# Altium schematic sheet ZYNQ_SOC.SchDoc
size A4
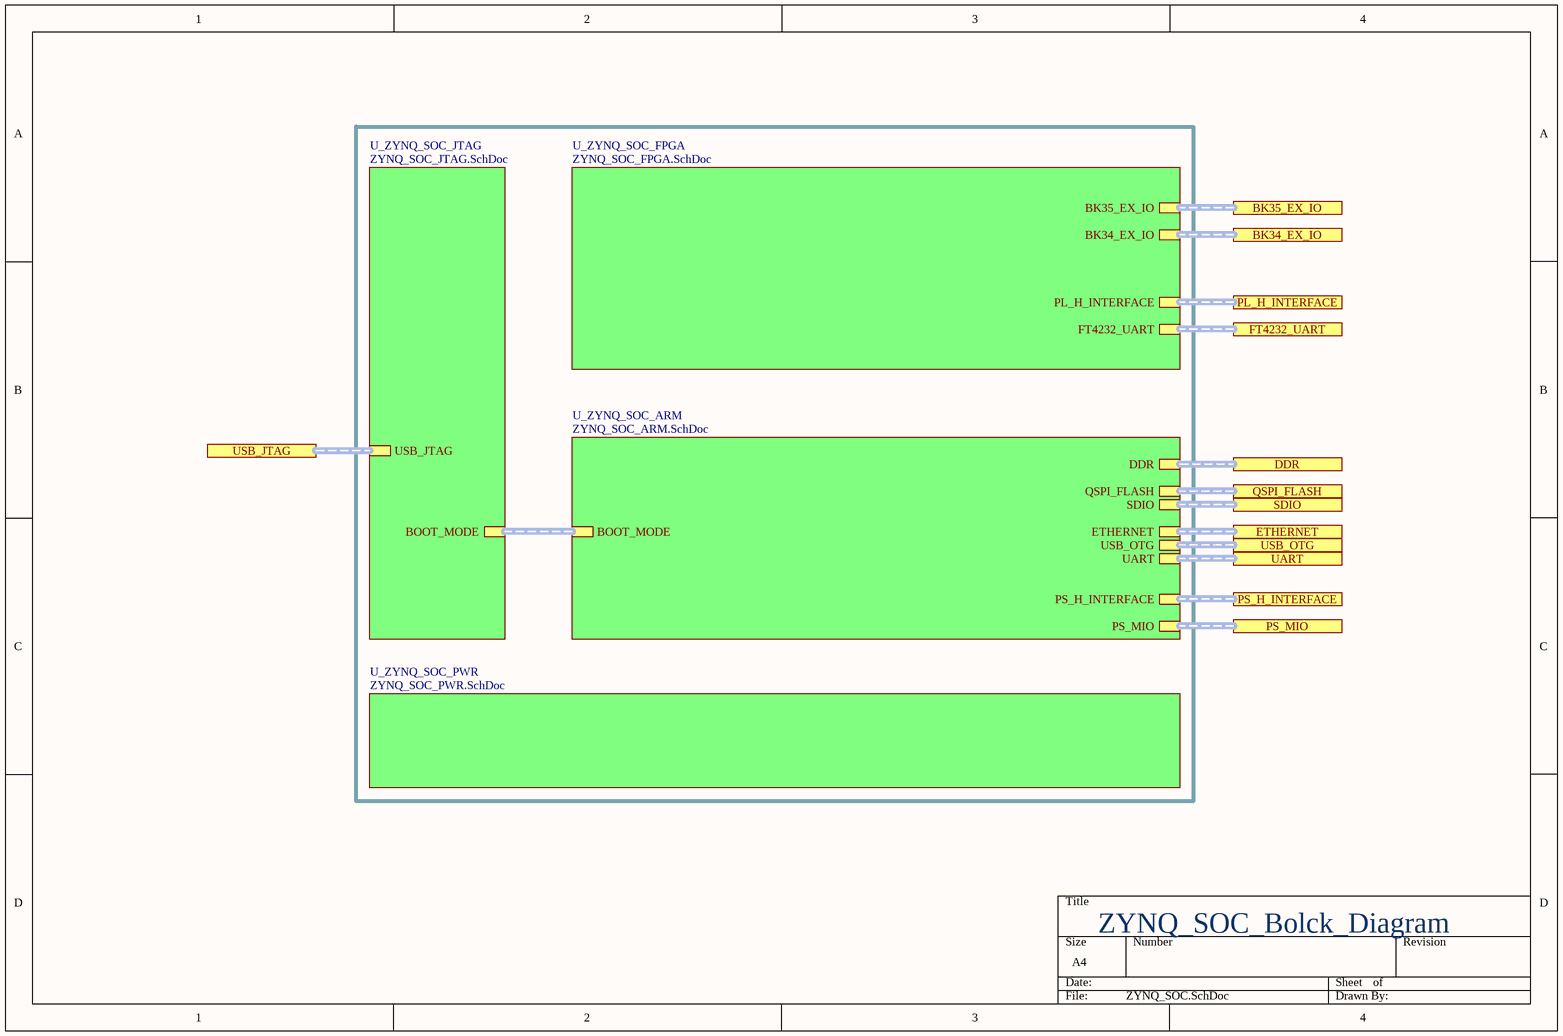
[diagram p0: ZYNQ_SOC.SchDoc]

## Sub-sheets
U_ZYNQ_SOC_ARM = ZYNQ_SOC_ARM.SchDoc: QSPI_FLASH (harness QSPI_FLASH), SDIO (harness SDIO), UART (harness UART), DDR (harness DDR), BOOT_MODE (harness BOOT_MODE), PS_H_INTERFACE (harness PS_H_INTERFACE), PS_MIO (harness PS_MIO), ETHERNET (harness ETHERNET), USB_OTG (harness USB_OTG)
U_ZYNQ_SOC_FPGA = ZYNQ_SOC_FPGA.SchDoc: BK35_EX_IO (harness BK35_EX_IO), BK34_EX_IO (harness BK34_EX_IO), PL_H_INTERFACE (harness PL_H_INTERFACE), FT4232_UART (harness FT4232_UART)
U_ZYNQ_SOC_JTAG = ZYNQ_SOC_JTAG.SchDoc: BOOT_MODE (harness BOOT_MODE), USB_JTAG (harness JTAG)
U_ZYNQ_SOC_PWR = ZYNQ_SOC_PWR.SchDoc: no entries

## Ports
BK34_EX_IO, BK35_EX_IO, DDR, ETHERNET, FT4232_UART, PL_H_INTERFACE, PS_H_INTERFACE, PS_MIO, QSPI_FLASH, SDIO, UART, USB_JTAG, USB_OTG

## Buses and harness runs
harness port BK34_EX_IO = sheet U_ZYNQ_SOC_FPGA/BK34_EX_IO
harness port BK35_EX_IO = sheet U_ZYNQ_SOC_FPGA/BK35_EX_IO
harness port DDR = sheet U_ZYNQ_SOC_ARM/DDR
harness port ETHERNET = sheet U_ZYNQ_SOC_ARM/ETHERNET
harness port FT4232_UART = sheet U_ZYNQ_SOC_FPGA/FT4232_UART
harness port PL_H_INTERFACE = sheet U_ZYNQ_SOC_FPGA/PL_H_INTERFACE
harness port PS_H_INTERFACE = sheet U_ZYNQ_SOC_ARM/PS_H_INTERFACE
harness port PS_MIO = sheet U_ZYNQ_SOC_ARM/PS_MIO
harness port QSPI_FLASH = sheet U_ZYNQ_SOC_ARM/QSPI_FLASH
harness port SDIO = sheet U_ZYNQ_SOC_ARM/SDIO
harness port UART = sheet U_ZYNQ_SOC_ARM/UART
harness port USB_JTAG = sheet U_ZYNQ_SOC_JTAG/USB_JTAG
harness port USB_OTG = sheet U_ZYNQ_SOC_ARM/USB_OTG
harness sheet U_ZYNQ_SOC_ARM/BOOT_MODE = sheet U_ZYNQ_SOC_JTAG/BOOT_MODE

## Notes on the sheet
- ZYNQ_SOC_Bolck_Diagram